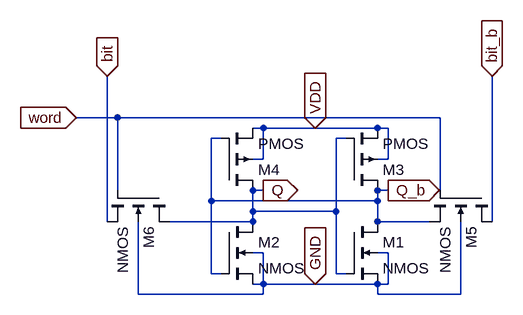
[diagram p0: schematic sram.asc]
sram.asc, the LTspice schematic file:
Version 4
SHEET 1 880 680
WIRE -112 64 -176 64
WIRE 384 64 -112 64
WIRE 112 80 96 80
WIRE 192 80 112 80
WIRE 288 80 192 80
WIRE 304 80 288 80
WIRE 48 96 32 96
WIRE 240 96 224 96
WIRE 112 128 112 80
WIRE 112 128 96 128
WIRE 304 128 304 80
WIRE 304 128 288 128
WIRE -112 176 -112 64
WIRE 112 176 96 176
WIRE 304 176 288 176
WIRE 384 176 384 64
WIRE 32 192 32 96
WIRE 288 192 288 176
WIRE 288 192 32 192
WIRE 96 208 96 176
WIRE 224 208 224 96
WIRE 224 208 96 208
WIRE -128 224 -128 0
WIRE 96 224 96 208
WIRE 96 224 -32 224
WIRE 288 224 288 192
WIRE 368 224 288 224
WIRE 464 224 464 0
WIRE 112 272 96 272
WIRE 304 272 288 272
WIRE 32 304 32 192
WIRE 48 304 32 304
WIRE 224 304 224 208
WIRE 240 304 224 304
WIRE 112 320 112 272
WIRE 112 320 96 320
WIRE 192 320 112 320
WIRE 288 320 192 320
WIRE 304 320 304 272
WIRE 304 320 288 320
WIRE -80 336 -80 224
WIRE 112 336 112 320
WIRE 112 336 -80 336
WIRE 288 336 288 320
WIRE 416 336 416 224
WIRE 416 336 288 336
FLAG -128 0 bit
IOPIN -128 0 In
FLAG 464 0 bit_b
IOPIN 464 0 In
FLAG -176 64 word
IOPIN -176 64 In
FLAG 192 80 VDD
IOPIN 192 80 In
FLAG 192 320 GND
IOPIN 192 320 In
FLAG 112 176 Q
IOPIN 112 176 Out
FLAG 304 176 Q_b
IOPIN 304 176 Out
SYMBOL nmos4 240 224 R0
SYMATTR InstName M1
SYMATTR Value2 l=2 w=8
SYMBOL nmos4 48 224 R0
SYMATTR InstName M2
SYMATTR Value2 l=2 w=8
SYMBOL pmos4 240 176 M180
SYMATTR InstName M3
SYMATTR Value2 l=3 w=3
SYMBOL pmos4 48 176 M180
SYMATTR InstName M4
SYMATTR Value2 l=3 w=3
SYMBOL nmos4 464 176 R90
SYMATTR InstName M5
SYMATTR Value2 l=2 w=4
SYMBOL nmos4 -32 176 R90
SYMATTR InstName M6
SYMATTR Value2 l=2 w=4

The netlist it stands for:
* sram.asc
M1 Q_b Q GND GND NMOS l=2 w=8
M2 Q Q_b GND GND NMOS l=2 w=8
M3 Q_b Q VDD VDD PMOS l=3 w=3
M4 Q Q_b VDD VDD PMOS l=3 w=3
M5 bit_b word Q_b GND NMOS l=2 w=4
M6 Q word bit GND NMOS l=2 w=4
.model NMOS NMOS
.model PMOS PMOS
.lib standard.mos
.backanno
.end